# Altium schematic sheet 004_FOC_RS_Interface.SchDoc
size A4; Organization: OLTEST; Revision: 01; SheetNumber: 4; SheetTotal: 12; Название листа: Название листа; Разработчик: Бондарчук С.; Прибор: R100; АМАК.000000.000 Э3: R100.220.040.000 Э3; Дата: 05.01.2018; Формат: A4
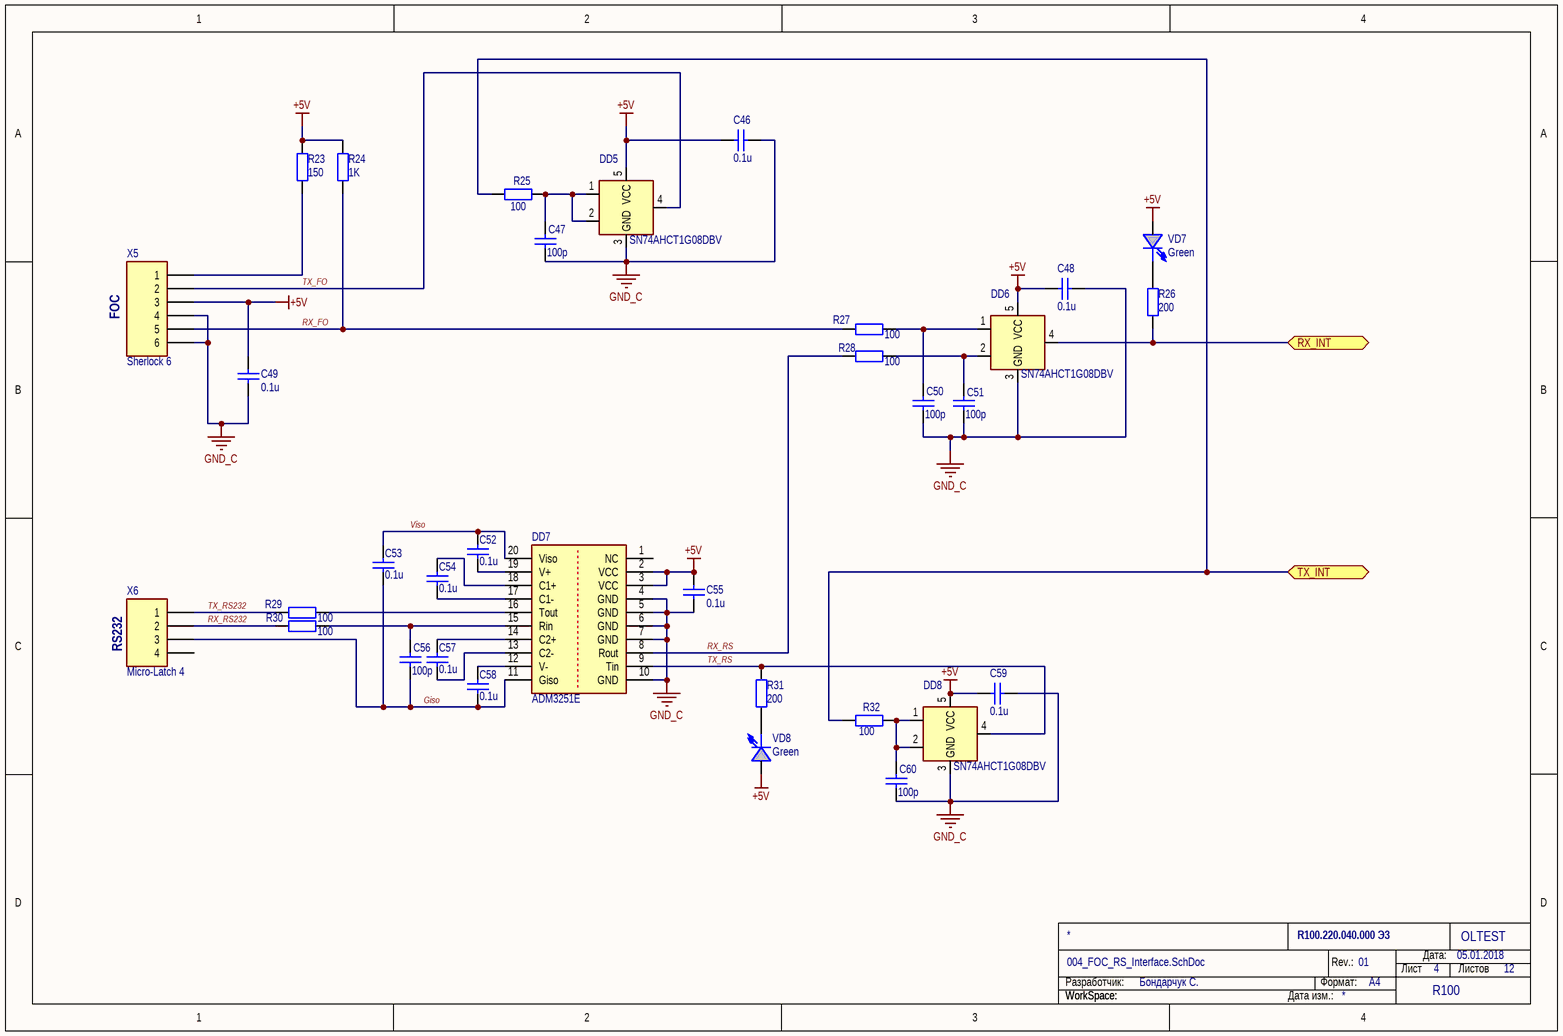
[diagram p0: 004_FOC_RS_Interface.SchDoc]

## Parts
C46  0.1u  [SMD_C_0603]
C47  100p  [SMD_C_0603]
C48  0.1u  [SMD_C_0603]
C49  0.1u  [SMD_C_0603]
C50  100p  [SMD_C_0603]
C51  100p  [SMD_C_0603]
C52  0.1u  [SMD_C_0603]
C53  0.1u  [SMD_C_0603]
C54  0.1u  [SMD_C_0603]
C55  0.1u  [SMD_C_0603]
C56  100p  [SMD_C_0603]
C57  0.1u  [SMD_C_0603]
C58  0.1u  [SMD_C_0603]
C59  0.1u  [SMD_C_0603]
C60  100p  [SMD_C_0603]
DD5  SN74AHCT1G08DBV  [SOT-23(DBV)]
DD6  SN74AHCT1G08DBV  [SOT-23(DBV)]
DD7  ADM3251E  [RW-20]
DD8  SN74AHCT1G08DBV  [SOT-23(DBV)]
R23  150  [SMD_R_0805]
R24  1K  [SMD_R_0603]
R25  100  [SMD_R_0603]
R26  200  [SMD_R_0805]
R27  100  [SMD_R_0603]
R28  100  [SMD_R_0603]
R29  100  [SMD_R_0603]
R30  100  [SMD_R_0603]
R31  200  [SMD_R_0805]
R32  100  [SMD_R_0603]
VD7  value Green  [SMD_LED_LL_Green]  (hidden comment: LL-S172GC-2A)
VD8  value Green  [SMD_LED_LL_Green]  (hidden comment: LL-S172GC-2A)
X5  Sherlock 6  [35362-0650]
X6  Micro-Latch 4  [53253-0470]

## Ports
RX_INT, TX_INT

## Nets
+5V: C46.1 C48.1 C49.2 C55.2 C59.1 DD5.5(VCC) DD6.5(VCC) DD7.2(VCC) DD7.3(VCC) DD8.5(VCC) R23.2 R24.2 VD7.1(ANODE) VD8.1(ANODE) X5.3
GND_C: C46.2 C47.1 C48.2 C49.1 C50.1 C51.2 C55.1 C59.2 C60.1 DD5.3(GND) DD6.3(GND) DD7.4(GND) DD7.5(GND) DD7.6(GND) DD7.7(GND) DD7.10(GND) DD8.3(GND) X5.4 X5.6
Giso: C53.1 C56.1 C58.1 DD7.11(Giso) X6.3
RX_FO: R24.1 R27.1 X5.5
RX_INT: DD6.4 R26.1 ; port RX_INT
RX_RS: DD7.8(Rout) R28.1
RX_RS232: R30.1 X6.2
TX_FO: DD5.4 X5.2
TX_INT: R25.1 R32.1 ; port TX_INT
TX_RS: DD7.9(Tin) DD8.4 R31.2
TX_RS232: R29.1 X6.1
Viso: C52.2 C53.2 DD7.20(Viso)
NetC47_2: C47.2 DD5.1 DD5.2 R25.2
NetC50_2: C50.2 DD6.1 R27.2
NetC51_1: C51.1 DD6.2 R28.2
NetC52_1: C52.1 DD7.19(V+)
NetC54_1: C54.1 DD7.17(C1-)
NetC54_2: C54.2 DD7.18(C1+)
NetC56_2: C56.2 DD7.15(Rin) R30.2
NetC57_1: C57.1 DD7.13(C2-)
NetC57_2: C57.2 DD7.14(C2+)
NetC58_2: C58.2 DD7.12(V-)
NetC60_2: C60.2 DD8.1 DD8.2 R32.2
NetDD7_16: DD7.16(Tout) R29.2
NetR23_1: R23.1 X5.1
NetR26_2: R26.2 VD7.2(CATHODE)
NetR31_1: R31.1 VD8.2(CATHODE)

Not connected (* = marked no-connect by the designer): DD7 1(NC); X6 4

## Notes on the sheet
- (near X5) FOC
- (near X6) RS232
- Разработчик:
- Формат:
- Rev.:
- Лист
- Дата:
- Листов
- WorkSpace:
- Дата изм.:
- (in symbol SN74AHCT1G08DBV) &

## Library data of the parts
C46 C48 C49 C52-C55 C57-C59 = C0603 0.1u 50V 10%: SMD C 0603 MURATA 50V 10% X7R; PartNumber: GRM188R71H104K; Manufacturer: MURATA; Value: 0.1u
C47 C50 C51 C56 C60 = C0603 100p 100V 5%: SMD C 0603 MURATA 100V 5% NP0; PartNumber: GRM1885C2A101JA01; Manufacturer: MURATA; Value: 100p
DD5 DD6 DD8 = SN74AHCT1G08DBV: 2-in AND; Manufacturer: Texas Instruments; PartNumber: SN74AHCT1G08DBV
DD7 = ADM3251E: Isolated, Single-Channel, RS-232 Line Driver/Receiver; Manufacturer: Analog Device; PartNumber: ADM3251EARWZ
R23 = R0805 150 1%: SMD 0805 VISHAY 0.125W 150V 1% 100ppm; PartNumber: CRCW0805150RFK; Manufacturer: VISHAY; Value: 150
R24 = R0603 1K 1%: SMD R 0603 VISHAY 0.1W 75V 1% 100ppm; PartNumber: CRCW06031K00FK; Manufacturer: VISHAY; Value: 1K
R25 R27-R30 R32 = R0603 100 1%: SMD R 0603 VISHAY 0.1W 75V 1% 100ppm; PartNumber: CRCW0603100RFK; Manufacturer: VISHAY; Value: 100
R26 R31 = R0805 200 1%: SMD R 0805 VISHAY 0.125W 150V 1% 100ppm; PartNumber: CRCW0805200RFK; Manufacturer: VISHAY; Value: 200
VD7 VD8 = LL-S172GC-2A: LED Green SMD; Manufacturer: Lucky Light; PartNumber: LL-S172GC-2A
X5 = 35363-0650: Sherlock 6 Side, 2A 125V 2mm; Manufacturer: MOLEX; PartNumber: 35362-0650
X6 = 53253-0470: Micro-Latch 4  LS=2 2A 125V PCB; Manufacturer: MOLEX; PartNumber: 53253-0470